# Altium schematic sheet Cable.SchDoc
size A4
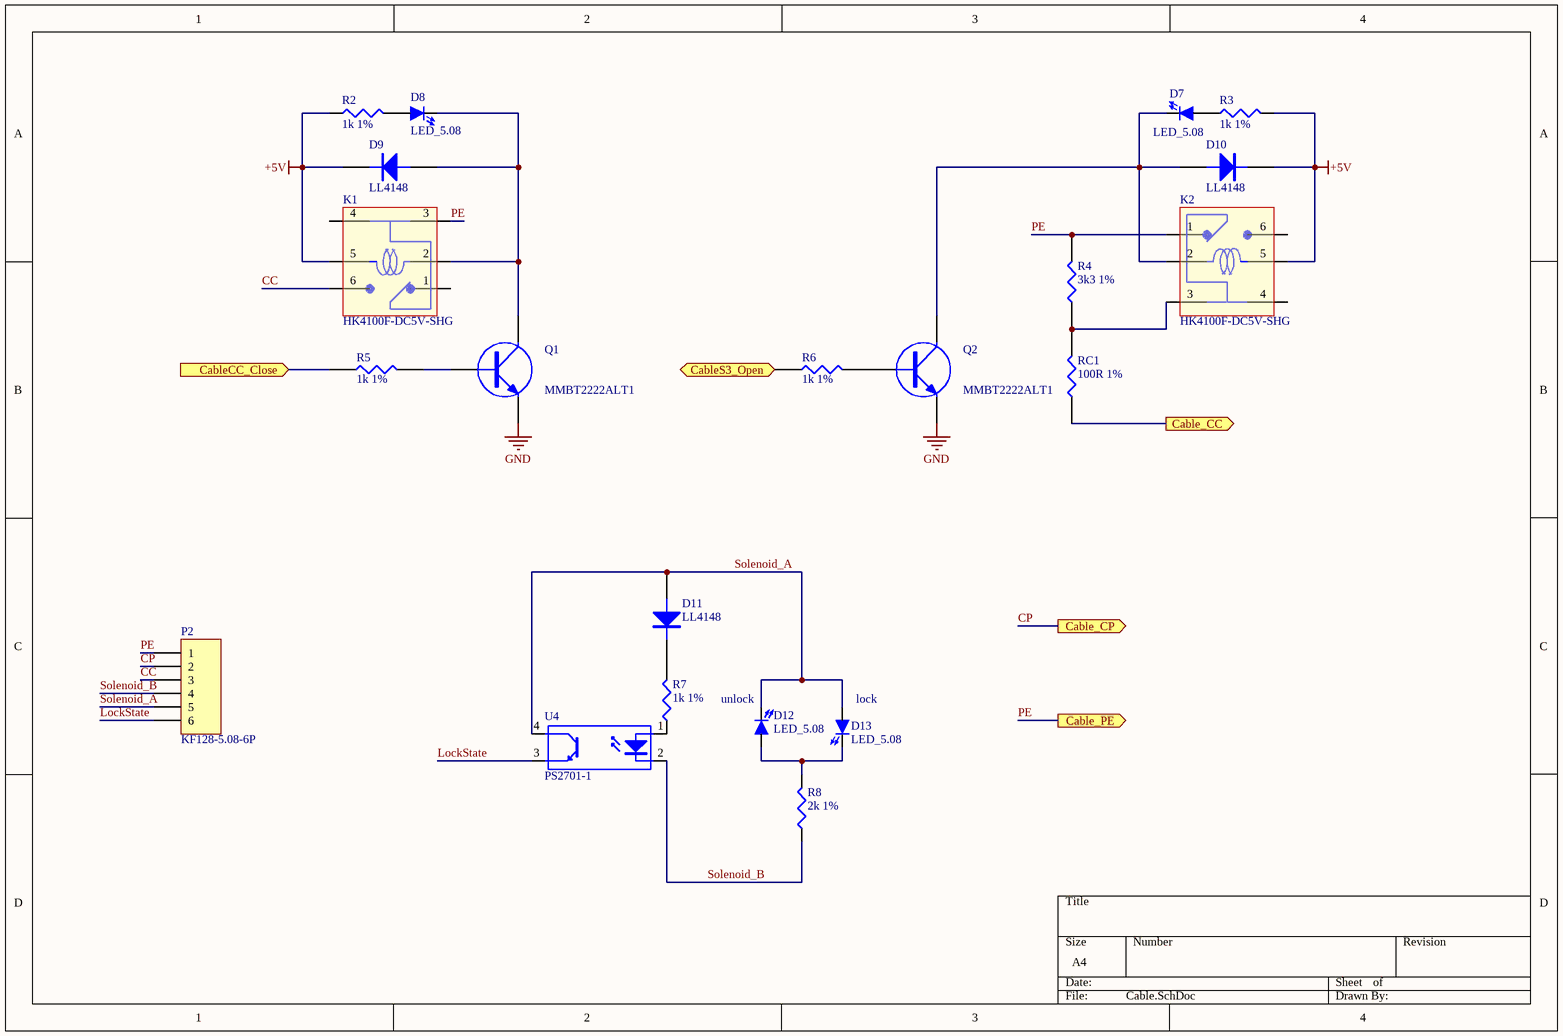
[diagram p0: Cable.SchDoc]

## Parts
D7  LED_5.08  [LED5.08/2.54-2]
D8  LED_5.08  [LED5.08/2.54-2]
D9  LL4148  [MELF-D3513-1405]
D10  LL4148  [MELF-D3513-1405]
D11  LL4148  [MELF-D3513-1405]
D12  LED_5.08  [LED5.08/2.54-2]
D13  LED_5.08  [LED5.08/2.54-2]
K1  HK4100F-DC5V-SHG  [HK4100F-DC5V-SHG]
K2  HK4100F-DC5V-SHG  [HK4100F-DC5V-SHG]
P2  KF128-5.08-6P  [KF128-5.08-6P]
Q1  MMBT2222ALT1  [SOT23-3M]
Q2  MMBT2222ALT1  [SOT23-3M]
R2  1k 1%  [RESC2012N]
R3  1k 1%  [RESC2012N]
R4  3k3 1%  [RESC2012N]
R5  1k 1%  [RESC2012N]
R6  1k 1%  [RESC2012N]
R7  1k 1%  [RESC2012N]
R8  2k 1%  [RESC2012N]
RC1  100R 1%  [RESC2012N]
U4  PS2701-1  [SOP4 for PS2701-1]

## Ports
Cable_CC (out), Cable_CP (out), Cable_PE (out), CableCC_Close (in), CableS3_Open (in)

## Nets
+5V: D9.2(K) D10.2(K) K1.5 K2.5 R2.1 R3.2
GND: Q1.2(E) Q2.2(E)
Cable_CC: RC1.1 ; port Cable_CC
CableCC_Close: R5.1 ; port CableCC_Close
CableS3_Open: R6.1 ; port CableS3_Open
CC: K1.6 P2.3
CP: P2.2 ; port Cable_CP
LockState: P2.6 U4.3(E)
PE: K1.3 K2.1 P2.1 R4.2 ; port Cable_PE
Solenoid_A: D11.1(A) D12.2(K) D13.1(A) P2.5 U4.4(C)
Solenoid_B: P2.4 R8.1 U4.2(K)
NetD7_1: D7.1(A) R3.1
NetD7_2: D7.2(K) D10.1(A) K2.2 Q2.3(C)
NetD8_1: D8.1(A) R2.2
NetD8_2: D8.2(K) D9.1(A) K1.2 Q1.3(C)
NetD11_2: D11.2(K) R7.2
NetD12_1: D12.1(A) D13.2(K) R8.2
NetK2_3: K2.3 R4.1 RC1.2
NetQ1_1: Q1.1(B) R5.2
NetQ2_1: Q2.1(B) R6.2
NetR7_1: R7.1 U4.1(A)

Not connected (* = marked no-connect by the designer): K1 1 4; K2 4 6

## Notes on the sheet
- (near D12) unlock
- (near D13) lock

## Library data of the parts
D7 D8 D12 D13 = LED_5.08: Through hole LED dia.5.08
D9-D11 = DIODE: Price: 0.03
K1 K2 = HK4100F-DC5V-SHG: HUI KE DC5V relay
P2 = Header 6: Pilot connectors; LatestRevisionDate: 17-Jul-2002; LatestRevisionNote: Re-released for DXP Platform.; Publisher: Altium Limited
Q1 Q2 = NPN: Price: 0.25
R2 R3 R7 R8 = Res3: Resistor
R4-R6 RC1 = RES1
U4 = PS2701-1: Photocoupler; Price: 0.52